# EAGLE schematic Audio_Amp_Rev_A (EAGLE 7.2.0)
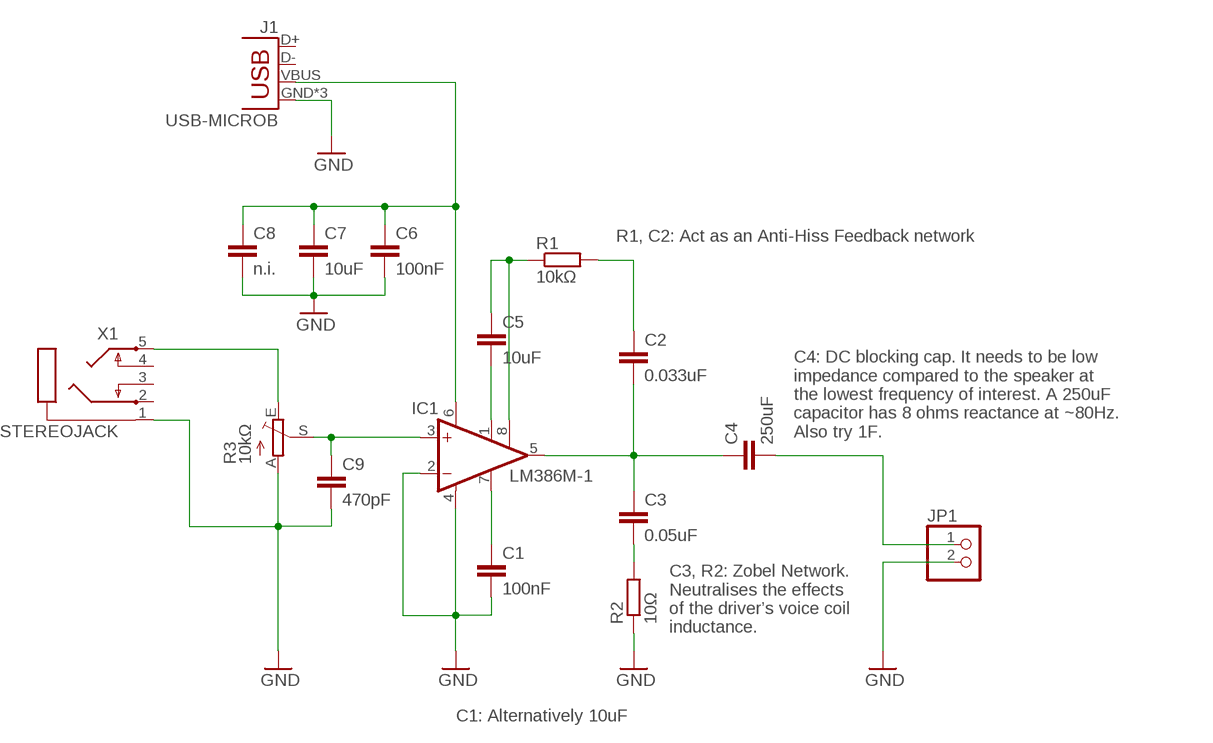
[diagram p0: schematic, sheet 1]

## Parts
C1  100nF  C-EUC0805  [C0805]
C2  0.033uF  C-EUC0805  [C0805]
C3  0.05uF  C-EUC0805  [C0805]
C4  250uF  C-EUC0805  [C0805]
C5  10uF  C-EUC0805  [C0805]
C6  100nF  C-EUC0805  [C0805]
C7  10uF  C-EUC0805  [C0805]
C8  n.i.  C-EUC0805  [C0805]
C9  470pF  C-EUC0805  [C0805]
IC1  LM386M-1  [SO08]
J1  USB-MICROB  [USB-MICROB]
JP1  PINHD-1X2  [1X02]
R1  10kΩ  R-EU_R0805  [R0805]
R2  10Ω  R-EU_R0805  [R0805]
R3  10kΩ  TRIM_EU-CIP20C-6MM  [CIP20C-6MM]
X1  STEREOJACK  [STX3100]

## Nets
GND: C1.2 C6.2 C7.2 C8.2 C9.2 IC1.2(-IN) IC1.4(GND) J1.GND J1.MT1(GND) J1.MT2(GND) JP1.2 R2.1 R3.A X1.1
N$1: C1.1 IC1.7(BYPASS)
N$2: C9.1 IC1.3(+IN) R3.S
N$3: C2.2 C3.1 C4.1 IC1.5(OUT)
N$4: C5.1 IC1.8(GAIN) R1.1
N$5: C2.1 R1.2
N$6: C3.2 R2.2
N$7: C4.2 JP1.1
N$8: R3.E X1.5
N$9: C5.2 IC1.1(GAIN)
N$10: C6.1 C7.1 C8.1 IC1.6(VS) J1.VBUS
Unconnected: J1.D+ J1.D- X1.2 X1.3 X1.4

## Notes on the sheet
- R1, C2: Act as an Anti-Hiss Feedback network
- C4: DC blocking cap. It needs to be low 
  impedance compared to the speaker at 
  the lowest frequency of interest. A 250uF
  capacitor has 8 ohms reactance at ~80Hz.
  Also try 1F.
- C3, R2: Zobel Network. 
  Neutralises the effects 
  of the driver’s voice coil 
  inductance.
- C1: Alternatively 10uF

## Library data of the parts
C1-C9 = rcl:C-EU: CAPACITOR, European symbol
IC1 = linear:LM386?-*: Low Voltage Audio Power Amplifier Source: http://cache.national.com/ds/LM/LM386.pdf
J1 = SparkFun-Connectors:USB: USB Connectors USB-B-PTH is fully proven SKU : PRT-00139/CONN-08278 USB-miniB is fully proven SKU : PRT-00587 USB-A-PCB is untested. USB-A-H is throughly reviewed, but untested. Spark Fun Electronics SKU : PRT-00437 USB-B-SMT is throughly reviewed, but untested. Needs silkscreen touching up. USB-A-S has not been used/tested USB-MB-H has not been used/tested USB-MICROB has been used. CONN-09505; PROD_ID: CONN-09505
JP1 = pinhead:PINHD-1X2: PIN HEADER
R1 R2 = rcl:R-EU_: RESISTOR, European symbol
R3 = pot:TRIM_EU-: POTENTIOMETER
X1 = adafruit:STEREOJACK: MIC/HEADPHONE JACK Stereo jack with two switches. Kycon STX3100, CUI SJ1-3555NG and/or 4UCon 05544